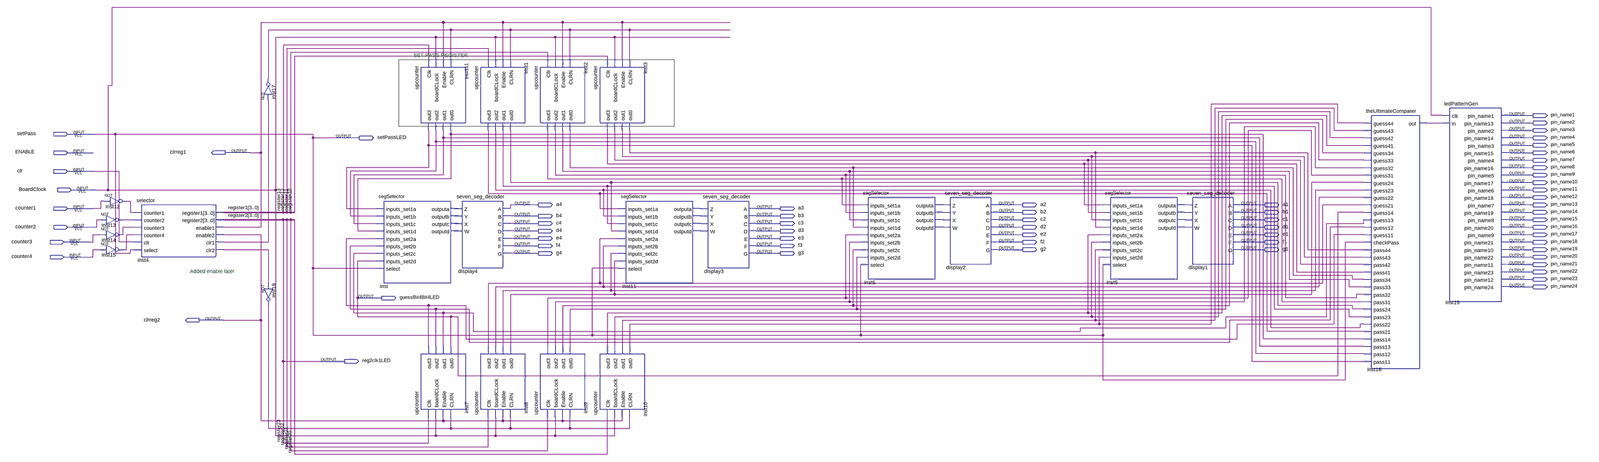
[diagram p0: schematic sheet, whole]
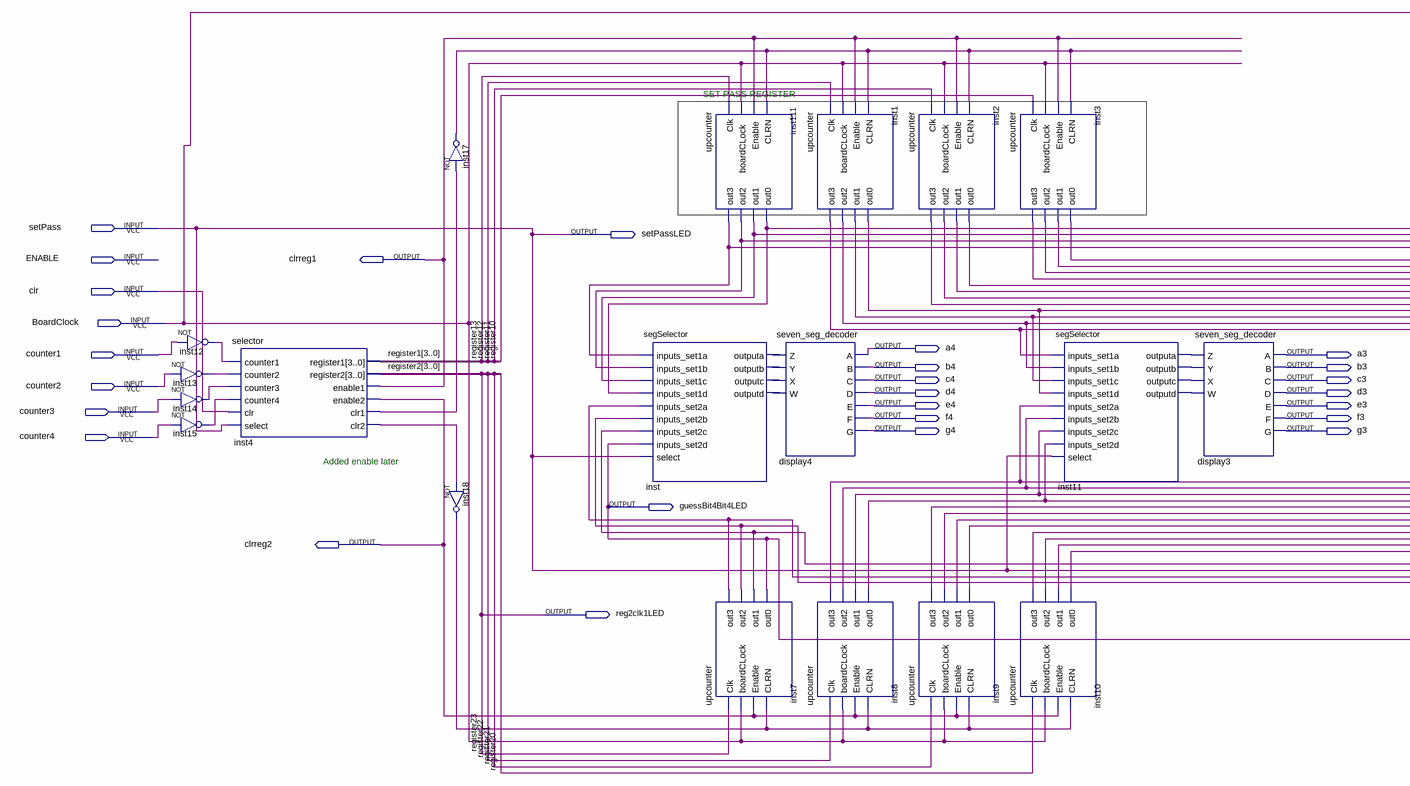
[diagram p1: schematic sheet, left part]
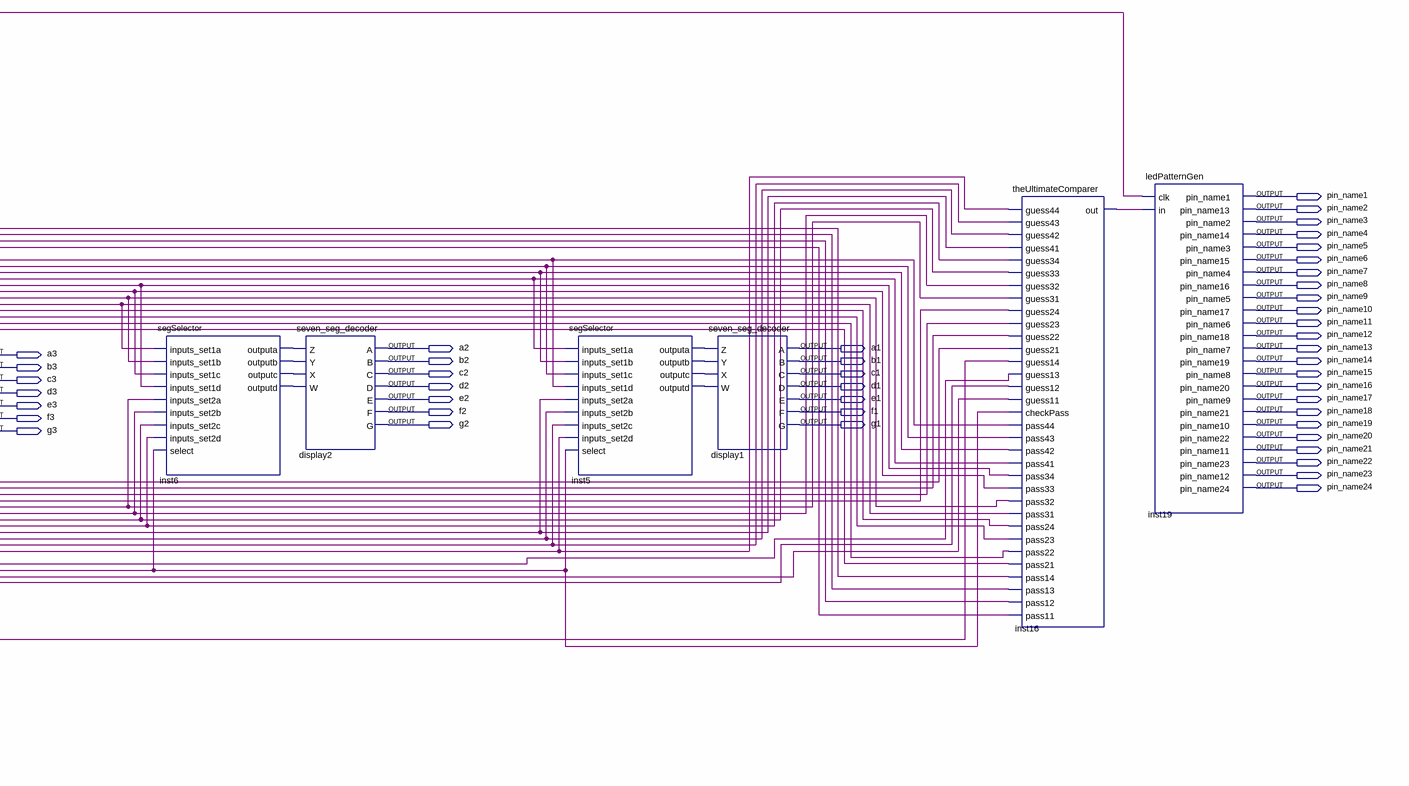
[diagram p2: schematic sheet, right part]
// Quartus schematic finalproject.bdf as structural Verilog: 25 symbols, 65 pins
module finalproject (
  input  setPass,
  input  ENABLE,
  input  clr,
  input  BoardClock,
  input  counter1,
  input  counter2,
  input  counter3,
  input  counter4,
  output pin_name1,
  output pin_name2,
  output pin_name3,
  output setPassLED,
  output pin_name4,
  output pin_name5,
  output clrreg1,
  output pin_name6,
  output pin_name7,
  output pin_name8,
  output pin_name9,
  output pin_name10,
  output pin_name11,
  output pin_name12,
  output a4,
  output a2,
  output a1,
  output pin_name13,
  output a3,
  output b2,
  output b1,
  output pin_name14,
  output b4,
  output b3,
  output c2,
  output c1,
  output pin_name15,
  output c4,
  output c3,
  output d2,
  output d1,
  output pin_name16,
  output d4,
  output d3,
  output e2,
  output e1,
  output pin_name17,
  output e4,
  output e3,
  output f2,
  output f1,
  output pin_name18,
  output f4,
  output f3,
  output g2,
  output g1,
  output pin_name19,
  output g4,
  output g3,
  output pin_name20,
  output pin_name21,
  output pin_name22,
  output pin_name23,
  output pin_name24,
  output guessBit4Bit4LED,
  output clrreg2,
  output reg2clk1LED
);

  wire inst1_out0, inst1_out1, inst1_out2, inst1_out3, inst2_out0, inst2_out1, inst2_out2, inst2_out3,
       inst3_out0, inst3_out1, inst3_out2, inst3_out3, inst4_clr1, inst4_clr2, inst5_outputa, inst5_outputb,
       inst5_outputc, inst5_outputd, inst6_outputa, inst6_outputb, inst6_outputc, inst6_outputd, inst7_out1,
       inst7_out2, inst7_out3, inst8_out0, inst8_out1, inst8_out2, inst8_out3, inst9_out0, inst9_out1,
       inst9_out2, inst9_out3, inst10_out0, inst10_out1, inst10_out2, inst10_out3, inst11_outputa,
       inst11_outputb, inst11_outputc, inst11_outputd, inst12_out, inst13_out, inst14_out, inst15_out,
       inst16_out, inst17_out, inst18_out, inst111_out0, inst111_out1, inst111_out2, inst111_out3,
       inst_outputa, inst_outputb, inst_outputc, inst_outputd;
  wire [2:0] register2;
  wire [3:0] register1;

  not inst12 (inst12_out, counter1);
  not inst13 (inst13_out, counter2);
  not inst14 (inst14_out, counter3);
  not inst15 (inst15_out, counter4);
  selector inst4 (
    .counter1(inst12_out), .counter2(inst13_out), .counter3(inst14_out), .counter4(inst15_out), .clr(clr),
    .select(setPass), .register1(register1), .register2({reg2clk1LED, register2}), .enable1(clrreg1),
    .enable2(clrreg2), .clr1(inst4_clr1), .clr2(inst4_clr2));
  not inst17 (inst17_out, inst4_clr1);
  not inst18 (inst18_out, inst4_clr2);
  segSelector inst (
    .inputs_set1a(inst111_out3), .inputs_set1b(inst111_out2), .inputs_set1c(inst111_out1),
    .inputs_set1d(inst111_out0), .inputs_set2a(inst7_out3), .inputs_set2b(inst7_out2),
    .inputs_set2c(inst7_out1), .inputs_set2d(guessBit4Bit4LED), .select(setPass), .outputa(inst_outputa),
    .outputb(inst_outputb), .outputc(inst_outputc), .outputd(inst_outputd));
  upcounter inst111 (
    .Clk(register1[3]), .boardCLock(BoardClock), .Enable(clrreg1), .CLRN(inst17_out), .out3(inst111_out3),
    .out2(inst111_out2), .out1(inst111_out1), .out0(inst111_out0));
  upcounter inst7 (
    .Clk(reg2clk1LED), .boardCLock(BoardClock), .Enable(clrreg2), .CLRN(inst18_out), .out3(inst7_out3),
    .out2(inst7_out2), .out1(inst7_out1), .out0(guessBit4Bit4LED));
  seven_seg_decoder display4 (
    .Z(inst_outputa), .Y(inst_outputb), .X(inst_outputc), .W(inst_outputd), .A(a4), .B(b4), .C(c4), .D(d4),
    .E(e4), .F(f4), .G(g4));
  upcounter inst1 (
    .Clk(register1[2]), .boardCLock(BoardClock), .Enable(clrreg1), .CLRN(inst17_out), .out3(inst1_out3),
    .out2(inst1_out2), .out1(inst1_out1), .out0(inst1_out0));
  upcounter inst8 (
    .Clk(register2[2]), .boardCLock(BoardClock), .Enable(clrreg2), .CLRN(inst18_out), .out3(inst8_out3),
    .out2(inst8_out2), .out1(inst8_out1), .out0(inst8_out0));
  upcounter inst2 (
    .Clk(register1[1]), .boardCLock(BoardClock), .Enable(clrreg1), .CLRN(inst17_out), .out3(inst2_out3),
    .out2(inst2_out2), .out1(inst2_out1), .out0(inst2_out0));
  upcounter inst9 (
    .Clk(register2[1]), .boardCLock(BoardClock), .Enable(clrreg2), .CLRN(inst18_out), .out3(inst9_out3),
    .out2(inst9_out2), .out1(inst9_out1), .out0(inst9_out0));
  upcounter inst3 (
    .Clk(register1[0]), .boardCLock(BoardClock), .Enable(clrreg1), .CLRN(inst17_out), .out3(inst3_out3),
    .out2(inst3_out2), .out1(inst3_out1), .out0(inst3_out0));
  upcounter inst10 (
    .Clk(register2[0]), .boardCLock(BoardClock), .Enable(clrreg2), .CLRN(inst18_out), .out3(inst10_out3),
    .out2(inst10_out2), .out1(inst10_out1), .out0(inst10_out0));
  segSelector inst11 (
    .inputs_set1a(inst1_out3), .inputs_set1b(inst1_out2), .inputs_set1c(inst1_out1),
    .inputs_set1d(inst1_out0), .inputs_set2a(inst8_out3), .inputs_set2b(inst8_out2),
    .inputs_set2c(inst8_out1), .inputs_set2d(inst8_out0), .select(setPass), .outputa(inst11_outputa),
    .outputb(inst11_outputb), .outputc(inst11_outputc), .outputd(inst11_outputd));
  seven_seg_decoder display3 (
    .Z(inst11_outputa), .Y(inst11_outputb), .X(inst11_outputc), .W(inst11_outputd), .A(a3), .B(b3), .C(c3),
    .D(d3), .E(e3), .F(f3), .G(g3));
  segSelector inst6 (
    .inputs_set1a(inst2_out3), .inputs_set1b(inst2_out2), .inputs_set1c(inst2_out1),
    .inputs_set1d(inst2_out0), .inputs_set2a(inst9_out3), .inputs_set2b(inst9_out2),
    .inputs_set2c(inst9_out1), .inputs_set2d(inst9_out0), .select(setPass), .outputa(inst6_outputa),
    .outputb(inst6_outputb), .outputc(inst6_outputc), .outputd(inst6_outputd));
  seven_seg_decoder display2 (
    .Z(inst6_outputa), .Y(inst6_outputb), .X(inst6_outputc), .W(inst6_outputd), .A(a2), .B(b2), .C(c2),
    .D(d2), .E(e2), .F(f2), .G(g2));
  segSelector inst5 (
    .inputs_set1a(inst3_out3), .inputs_set1b(inst3_out2), .inputs_set1c(inst3_out1),
    .inputs_set1d(inst3_out0), .inputs_set2a(inst10_out3), .inputs_set2b(inst10_out2),
    .inputs_set2c(inst10_out1), .inputs_set2d(inst10_out0), .select(setPass), .outputa(inst5_outputa),
    .outputb(inst5_outputb), .outputc(inst5_outputc), .outputd(inst5_outputd));
  seven_seg_decoder display1 (
    .Z(inst5_outputa), .Y(inst5_outputb), .X(inst5_outputc), .W(inst5_outputd), .A(a1), .B(b1), .C(c1),
    .D(d1), .E(e1), .F(f1), .G(g1));
  theUltimateComparer inst16 (
    .guess44(inst10_out0), .guess43(inst10_out1), .guess42(inst10_out2), .guess41(inst10_out3),
    .guess34(inst9_out0), .guess33(inst9_out1), .guess32(inst9_out2), .guess31(inst9_out3),
    .guess24(inst8_out0), .guess23(inst8_out1), .guess22(inst8_out2), .guess21(inst8_out3),
    .guess14(guessBit4Bit4LED), .guess13(inst7_out1), .guess12(inst7_out2), .guess11(inst7_out3),
    .checkPass(setPass), .pass44(inst3_out0), .pass43(inst3_out1), .pass42(inst3_out2), .pass41(inst3_out3),
    .pass34(inst2_out0), .pass33(inst2_out1), .pass32(inst2_out2), .pass31(inst2_out3), .pass24(inst1_out0),
    .pass23(inst1_out1), .pass22(inst1_out2), .pass21(inst1_out3), .pass14(inst111_out0),
    .pass13(inst111_out1), .pass12(inst111_out2), .pass11(inst111_out3), .out(inst16_out));
  ledPatternGen inst19 (
    .clk(BoardClock), .in(inst16_out), .pin_name1(pin_name1), .pin_name13(pin_name2), .pin_name2(pin_name3),
    .pin_name14(pin_name4), .pin_name3(pin_name5), .pin_name15(pin_name6), .pin_name4(pin_name7),
    .pin_name16(pin_name8), .pin_name5(pin_name9), .pin_name17(pin_name10), .pin_name6(pin_name11),
    .pin_name18(pin_name12), .pin_name7(pin_name13), .pin_name19(pin_name14), .pin_name8(pin_name15),
    .pin_name20(pin_name16), .pin_name9(pin_name17), .pin_name21(pin_name18), .pin_name10(pin_name19),
    .pin_name22(pin_name20), .pin_name11(pin_name21), .pin_name23(pin_name22), .pin_name12(pin_name23),
    .pin_name24(pin_name24));

  assign setPassLED = setPass;

  // Other names for the same wires on the sheet: register2[3] = reg2clk1LED; register23 = reg2clk1LED

  // Notes on the sheet:
  //   SET PASS REGISTER
  //   Added enable later
endmodule
